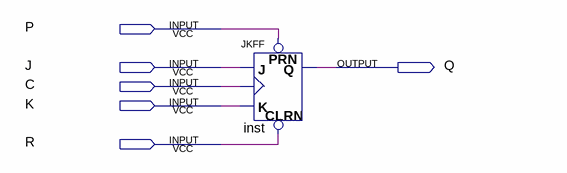
[diagram p0: schematic sheet]
// Quartus schematic point4.bdf as structural Verilog: 1 symbols, 6 pins
module point4 (
  input  P,
  input  J,
  input  C,
  input  K,
  input  R,
  output Q
);

  JKFF inst (.PRN(P), .CLRN(R), .K(K), .J(J), .CLK(C), .Q(Q));
endmodule
